# Altium project Hackathon_Electrical_Project.PrjPcb
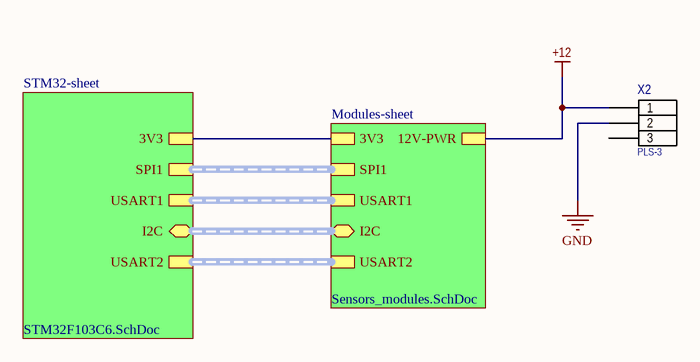
[diagram p0: Sheet1.SchDoc]
3 sheets, 33 parts. Net scope: hierarchical (ports join the sheet entries above them; power ports are global).
Board file: PCB_Hackathon.PcbDoc
Sheets:
  Sheet1.SchDoc
    Modules-sheet = Sensors_modules.SchDoc
    STM32-sheet = STM32F103C6.SchDoc

## Sheet Sheet1.SchDoc
size A4; SheetNumber: 1; SheetTotal: 3

### Parts
X2  PLS-3  [PLS-3-3D]

### Sub-sheets
Modules-sheet = Sensors_modules.SchDoc: SPI1 (harness SPI1), USART1 (harness USART1), I2C (bidir, harness I2C), USART2 (harness USART2), 3V3, 12V-PWR
STM32-sheet = STM32F103C6.SchDoc: SPI1 (harness SPI1), USART1 (harness USART1), I2C (bidir, harness I2C), USART2 (harness USART2), 3V3

### Nets
+12: X2.1 ; sheet Modules-sheet/12V-PWR  [project net 12V-PWR]
GND: X2.2
3V3-SYS: sheet Modules-sheet/3V3, sheet STM32-sheet/3V3

Not connected (* = marked no-connect by the designer): X2 3

### Buses and harness runs
harness sheet Modules-sheet/I2C = sheet STM32-sheet/I2C
harness sheet Modules-sheet/SPI1 = sheet STM32-sheet/SPI1
harness sheet Modules-sheet/USART1 = sheet STM32-sheet/USART1
harness sheet Modules-sheet/USART2 = sheet STM32-sheet/USART2

### Library data of the parts
X2 = PLS-3: Header, 3-Pin; LatestRevisionDate: 17-Jul-2002; LatestRevisionNote: Re-released for DXP Platform.; Publisher: Altium Limited

## Sheet Sensors_modules.SchDoc
size 209 x 297 mm; SheetNumber: 3; SheetTotal: 3
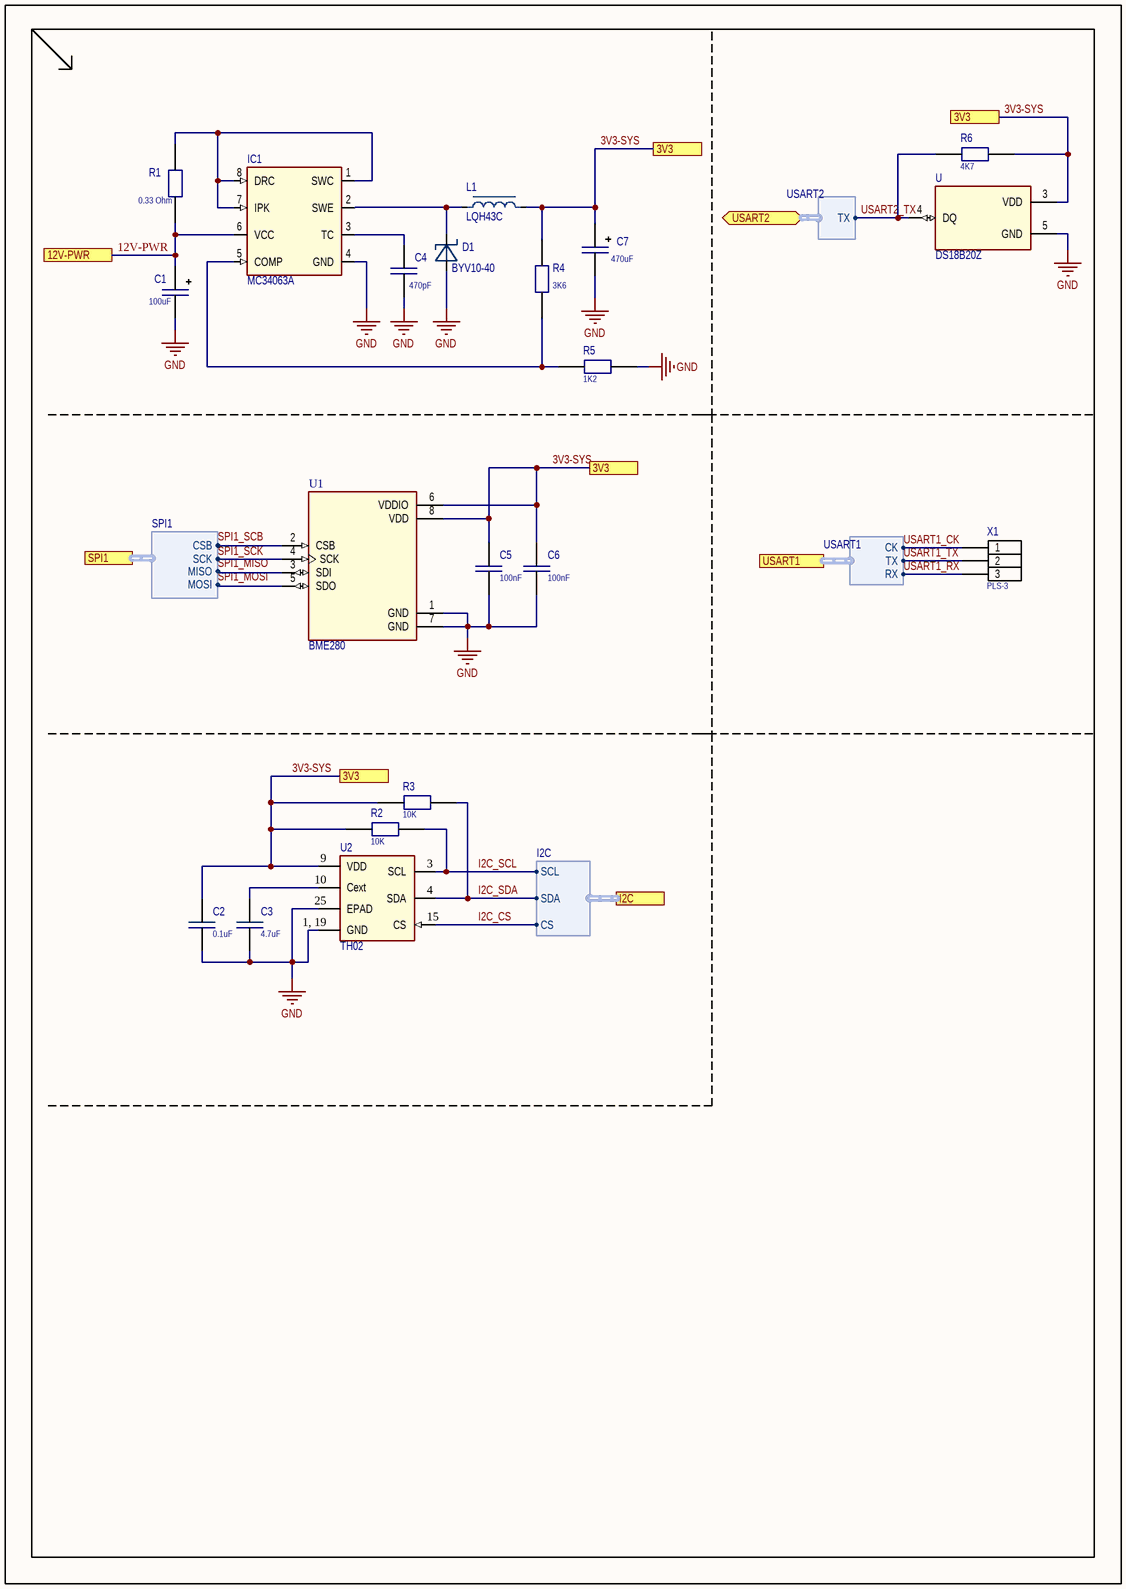
[diagram p1: Sensors_modules.SchDoc]

### Parts
C1  100uF  [CPM6032]
C2  0.1uF  [C_0805]
C3  4.7uF  [C_0805]
C4  470pF  [C_0805]
C5  100nF  [C_0805]
C6  100nF  [C_0805]
C7  470uF  [CPM6032]
D1  BYV10-40  [BYV10-40]
IC1  MC34063A  [SO08]
L1  LQH43C  [IND_LQH43CN2R2M03L]
R1  0.33 Ohm  [R_0402]
R2  10K  [R_0402]
R3  10K  [R_0402]
R4  3K6  [R_0402]
R5  1K2  [R_0402]
R6  4K7  [R_0402]
U  DS18B20Z  [SOIC127P600X175-8N]
U1  BME280  [PSON65P250X250X100-8N]
U2  TH02  [QFN-24]
X1  PLS-3  [PLS-3-3D]

### Ports
3V3, 12V-PWR, I2C (harness I2C), SPI1 (harness SPI1), USART1 (harness USART1), USART2 (bidir, harness USART2)

### Harnesses
SPI1: CSB, SCK, MISO, MOSI
USART1: TX, RX, CK
I2C: SCL, SDA, CS
USART2: TX

### Nets
12V-PWR: C1.2 IC1.6(VCC) R1.1 ; port 12V-PWR
GND: C1.1 C2.1 C3.1 C4.1 C5.1 C6.1 C7.1 D1.2 IC1.4(GND) R5.1 U.5(GND) U1.1(GND) U1.7(GND) U2.1,_19(GND) U2.25(EPAD)
3V3-SYS: C2.2 C5.2 C6.2 C7.2 L1.2 R2.2 R3.2 R4.2 R6.1 U.3(VDD) U1.6(VDDIO) U1.8(VDD) U2.9(VDD) ; port 3V3
I2C_CS: U2.15(CS) ; port I2C.CS
I2C_SCL: R2.1 U2.3(SCL) ; port I2C.SCL
I2C_SDA: R3.1 U2.4(SDA) ; port I2C.SDA
SPI1_MISO: U1.3(SDI) ; port SPI1.MISO
SPI1_MOSI: U1.5(SDO) ; port SPI1.MOSI
SPI1_SCB: U1.2(CSB)
SPI1_SCK: U1.4(SCK) ; port SPI1.SCK
USART1_CK: X1.1 ; port USART1.CK
USART1_RX: X1.3 ; port USART1.RX
USART1_TX: X1.2 ; port USART1.TX
USART2_TX: R6.2 U.4(DQ) ; port USART2.TX
NetC3_2: C3.2 U2.10(Cext)
NetC4_2: C4.2 IC1.3(TC)
NetD1_1: D1.1 IC1.2(SWE) L1.1
NetIC1_1: IC1.1(SWC) IC1.7(IPK) IC1.8(DRC) R1.2
NetIC1_5: IC1.5(COMP) R4.1 R5.2

### Library data of the parts
C1 C7 = CPM6032: Capacitor
  C1: Value: 100uF
  C7: Value: 470uF
C2-C6 = C0805: Capacitor
  C2: Value: 0.1uF
  C3: Value: 4.7uF
  C4: Value: 470pF
  C5 C6: Value: 100nF
D1 = BYV10-40: Diode Schottky
IC1 = MC34063A: Buck, Boost Switching Regulator IC Positive or Negative Adjustable 1.25V 1 Output 1.5A _Switch_ 8-SOIC _0.154, 3.90mm Width_; MF: Texas Instruments; Package: SOIC-8 Texas Instruments; MP: MC34063A; Availability: Unavailable; Price: None; Value: *; SnapEDA_Link: https://www.snapeda.com/parts/MC34063A/Texas%20Instruments/view-part/581314/?ref=snap
L1 = LQH43C: Inductor with Inductance: 2.2uH Tol. +/-20%, Package: 1812 (4532); MP: LQH43CN2R2M03L; MF: Murata; Package: NONSTANDARD; SnapEDA_Link: https://www.snapeda.com/parts/LQH43CN2R2M03L/Murata/view-part/4550537/?ref=snap; Purchase-URL: https://pricing.snapeda.com/search/part/LQH43CN2R2M03L/?ref=eda; Price: None; Value: *; Availability: Good
R1-R6 = R0402: Resistor
  R1: Value: 0.33 Ohm
  R2 R3: Value: 10K
  R4: Value: 3K6
  R5: Value: 1K2
  R6: Value: 4K7
U = DS18B20Z: Temperature Sensor Digital, Local -55Â°C ~ 125Â°C 12 b 8-SOIC; MP: DS18B20Z+; MF: Maxim Integrated; Availability: Unavailable; SnapEDA_Link: https://www.snapeda.com/parts/DS18B20Z%2B/Maxim%20Integrated/view-part/109391/?ref=snap; Value: *; Package: SOIC-8 Maxim; Price: None
U1 = BME280: DIGITAL HUMIDITY, PRESSURE AND TEMPERATURE SENSOR<br>* Digital interface IÂ²C (up to 3.4 MHz) and SPI (3 and 4 wire, up to 10 MHz)* Supply voltage VDD main supply voltage range: 1.71 V to 3.6 V*VDDIO interface voltage range: 1.2 V to 3.6 V<br> Operating range -40â€¦+85 Â°C, 0â€¦100 % rel. humidity, 300â€¦1100 hPa <br><br>  The library has been designed by<a href="https://www.facebook.com/groups/eaglecadsoftUK"> Richard Magdycz</a>; Package: None; Availability: Unavailable; MP: BME280; Value: *; Price: None
X1 = PLS-3: Header, 3-Pin; LatestRevisionDate: 17-Jul-2002; LatestRevisionNote: Re-released for DXP Platform.; Publisher: Altium Limited

## Sheet STM32F103C6.SchDoc
size 209 x 297 mm; SheetNumber: 2; SheetTotal: 3
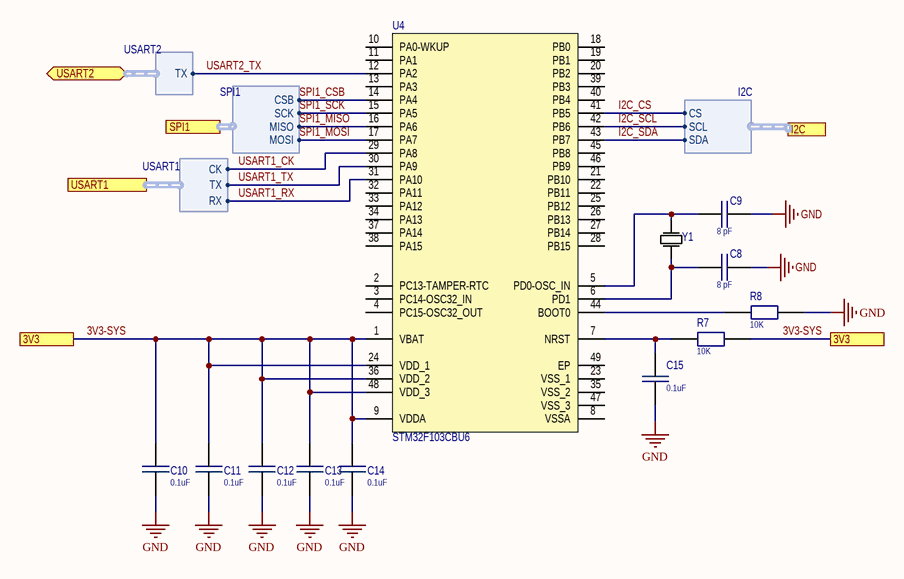
[diagram p2: STM32F103C6.SchDoc]

### Parts
C8  8 pF  [C_0805]
C9  8 pF  [C_0805]
C10  0.1uF  [C_0805]
C11  0.1uF  [C_0805]
C12  0.1uF  [C_0805]
C13  0.1uF  [C_0805]
C14  0.1uF  [C_0805]
C15  0.1uF  [C_0805]
R7  10K  [R_0402]
R8  10K  [R_0402]
U4  STM32F103CBU6  [STM-UFQFPN48_M]
Y1  (no value)  [NX3225GD]

### Ports
3V3, I2C (harness I2C), SPI1 (harness SPI1), USART1 (harness USART1), USART2 (bidir, harness USART2)

### Harnesses
SPI1: CSB, SCK, MISO, MOSI
USART1: CK, TX, RX
I2C: CS, SCL, SDA
USART2: TX

### Nets
GND: C8.2 C9.1 C10.2 C11.2 C12.2 C13.2 C14.2 C15.1 R8.2
3V3-SYS: C10.1 C11.1 C12.1 C13.1 C14.1 R7.2 U4.1(VBAT) U4.9(VDDA) U4.24(VDD_1) U4.36(VDD_2) U4.48(VDD_3) ; port 3V3
I2C_CS: U4.41(PB5) ; port I2C.CS
I2C_SCL: U4.42(PB6) ; port I2C.SCL
I2C_SDA: U4.43(PB7) ; port I2C.SDA
SPI1_CSB: U4.14(PA4) ; port SPI1.CSB
SPI1_MISO: U4.16(PA6) ; port SPI1.MISO
SPI1_MOSI: U4.17(PA7) ; port SPI1.MOSI
SPI1_SCK: U4.15(PA5) ; port SPI1.SCK
USART1_CK: U4.29(PA8) ; port USART1.CK
USART1_RX: U4.31(PA10) ; port USART1.RX
USART1_TX: U4.30(PA9) ; port USART1.TX
USART2_TX: U4.12(PA2) ; port USART2.TX
NetC8_1: C8.1 U4.6(PD1) Y1.1(OSC1)
NetC9_2: C9.2 U4.5(PD0-OSC_IN) Y1.2(OSC2)
NetC15_2: C15.2 R7.1 U4.7(NRST)
NetR8_1: R8.1 U4.44(BOOT0)

Not connected (* = marked no-connect by the designer): U4 2(PC13-TAMPER-RTC) 3(PC14-OSC32_IN) 4(PC15-OSC32_OUT) 8(VSSA) 10(PA0-WKUP) 11(PA1) 13(PA3) 18(PB0) 19(PB1) 20(PB2) 21(PB10) 22(PB11) 23(VSS_1) 25(PB12) 26(PB13) 27(PB14) 28(PB15) 32(PA11) 33(PA12) 34(PA13) 35(VSS_2) 37(PA14) 38(PA15) 39(PB3) 40(PB4) 45(PB8) 46(PB9) 47(VSS_3) 49(EP)

### Library data of the parts
C8-C15 = C0805: Capacitor
  C8 C9: Value: 8 pF
  C10-C15: Value: 0.1uF
R7 R8 = R0402: Resistor; Value: 10K
U4 = STM32F103CBU6: STM32 ARM-based 32-bit MCU Performance Line with 128 kB Flash, 20 kB Internal RAM, -40 to +85°C Temperature, 48-Pin VFQFPN, Tray; DatasheetVersion: rev13.0, Apr-2011; PackageVersion: 2011; PackageReference: VFQFPN48; PackageDescription: 48-Pin Quad Flat No-Lead, 7 x 7 x 0.9 mm Body, 0.5 mm Pitch, Exposed Pad; ComponentLink1Description: Manufacturer URL; ComponentLink1URL: http://www.st.com/; ComponentLink2Description: STM32F103 Datasheet; ComponentLink2URL: http://www.st.com/internet/com/TECHNICAL_RESOURCES/TECHNICAL_LITERATURE/DATASHEET/CD00161566.pdf; ComponentLink3Description: STM32 Family Web Page; ComponentLink3URL: www.st.com/stm32
Y1 = NX3225GD: Crystal Oscillator

## Nets that join several sheets
12V-PWR: Sheet1 (X2.1), Sensors_modules (C1.2 IC1.6 R1.1)
GND: Sheet1 (X2.2), Sensors_modules (15 pins), STM32F103C6 (9 pins)
3V3-SYS: Sensors_modules (13 pins), STM32F103C6 (11 pins)
I2C_CS: Sensors_modules (U2.15), STM32F103C6 (U4.41)
I2C_SCL: Sensors_modules (R2.1 U2.3), STM32F103C6 (U4.42)
I2C_SDA: Sensors_modules (R3.1 U2.4), STM32F103C6 (U4.43)
SPI1_MISO: Sensors_modules (U1.3), STM32F103C6 (U4.16)
SPI1_MOSI: Sensors_modules (U1.5), STM32F103C6 (U4.17)
SPI1_SCK: Sensors_modules (U1.4), STM32F103C6 (U4.15)
USART1_CK: Sensors_modules (X1.1), STM32F103C6 (U4.29)
USART1_RX: Sensors_modules (X1.3), STM32F103C6 (U4.31)
USART1_TX: Sensors_modules (X1.2), STM32F103C6 (U4.30)
USART2_TX: Sensors_modules (R6.2 U.4), STM32F103C6 (U4.12)